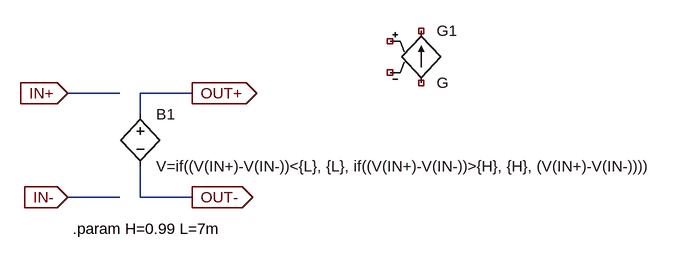
[diagram p0: schematic ILimit.asc]
ILimit.asc, the LTspice schematic file:
Version 4
SHEET 1 1116 680
WIRE 128 208 48 208
WIRE 240 208 160 208
WIRE 160 240 160 208
WIRE 128 368 48 368
WIRE 160 368 160 320
WIRE 240 368 160 368
FLAG 48 368 IN-
IOPIN 48 368 In
FLAG 240 208 OUT+
IOPIN 240 208 Out
FLAG 48 208 IN+
IOPIN 48 208 In
FLAG 240 368 OUT-
IOPIN 240 368 Out
SYMBOL bv 160 224 R0
SYMATTR InstName B1
SYMATTR Value V=if((V(IN+)-V(IN-))<{L}, {L}, if((V(IN+)-V(IN-))>{H}, {H}, (V(IN+)-V(IN-))))
SYMBOL g 592 96 R0
SYMATTR InstName G1
TEXT 56 416 Left 0 !.param H=0.99 L=7m

The netlist it stands for:
* ILimit.asc
B1 OUT+ OUT- V=if((V(IN+)-V(IN-))<{L}, {L}, if((V(IN+)-V(IN-))>{H}, {H}, (V(IN+)-V(IN-))))
G1 NC_01 NC_02 NC_03 NC_04 G
.param H=0.99 L=7m
.backanno
.end